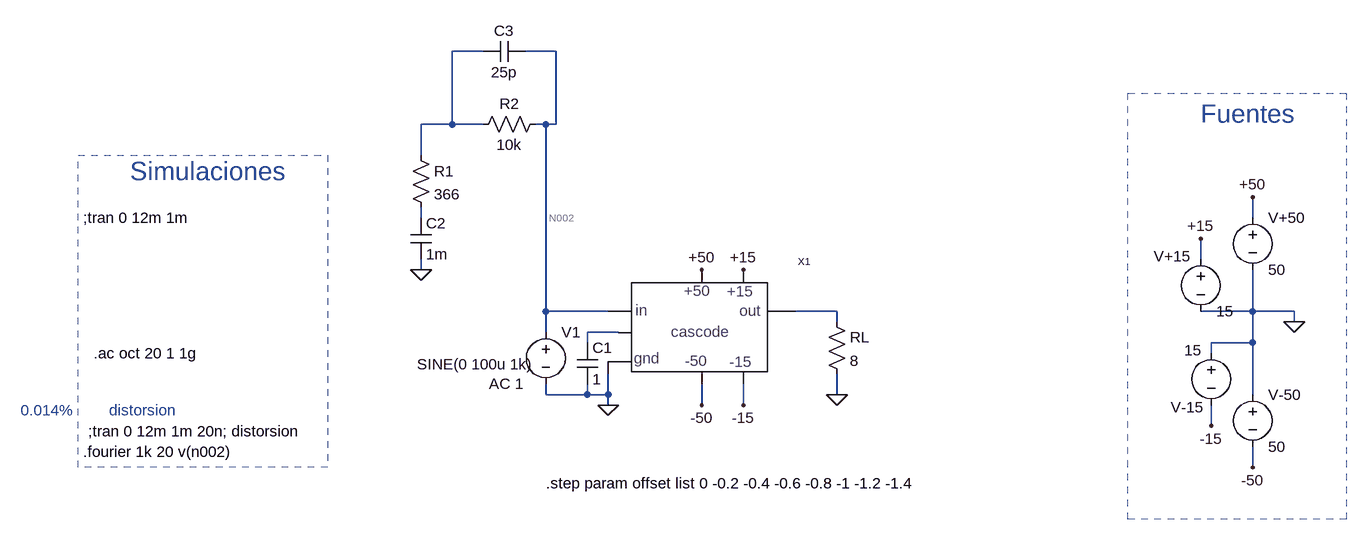
[diagram p0: schematic ampli-div-ten-la.asc]
ampli-div-ten-la.asc, the LTspice schematic file:
Version 4
SHEET 1 1188 880
WIRE -144 -288 -192 -288
WIRE -32 -288 -80 -288
WIRE -192 -176 -192 -288
WIRE -192 -176 -240 -176
WIRE -144 -176 -192 -176
WIRE -48 -176 -64 -176
WIRE -32 -176 -32 -288
WIRE -32 -176 -48 -176
WIRE -240 -128 -240 -176
WIRE -240 -32 -240 -48
WIRE 1040 -32 1040 -64
WIRE 960 32 960 0
WIRE -240 48 -240 32
WIRE -48 112 -48 -176
WIRE 48 112 -48 112
WIRE 400 112 336 112
WIRE 1040 112 1040 48
WIRE 1040 112 960 112
WIRE 1104 112 1040 112
WIRE 400 128 400 112
WIRE 1104 128 1104 112
WIRE -48 144 -48 112
WIRE 64 144 16 144
WIRE 16 160 16 144
WIRE 1040 160 1040 112
WIRE 1040 160 976 160
WIRE 976 176 976 160
WIRE -48 240 -48 224
WIRE 16 240 16 224
WIRE 16 240 -48 240
WIRE 48 240 48 208
WIRE 48 240 16 240
WIRE 400 240 400 208
WIRE 1040 240 1040 160
WIRE 48 256 48 240
WIRE 192 256 192 224
WIRE 256 256 256 224
WIRE 976 288 976 256
WIRE 1040 352 1040 320
FLAG 1104 128 0
FLAG 400 240 0
FLAG 1040 -64 +50
FLAG 960 0 +15
FLAG 976 288 -15
FLAG 1040 352 -50
FLAG 192 48 +50
FLAG 256 48 +15
FLAG 192 256 -50
FLAG 256 256 -15
FLAG 48 256 0
FLAG -240 48 0
SYMBOL rui\\shortcuts\\voltage 976 160 R0
WINDOW 0 -62 99 Left 2
WINDOW 3 -41 12 Left 2
WINDOW 123 0 0 Left 2
WINDOW 39 0 0 Left 2
SYMATTR InstName V-15
SYMATTR Value 15
SYMBOL rui\\shortcuts\\voltage 1040 -48 R0
SYMATTR InstName V+50
SYMATTR Value 50
SYMBOL rui\\shortcuts\\voltage 960 16 R0
WINDOW 0 -72 11 Left 2
SYMATTR InstName V+15
SYMATTR Value 15
SYMBOL rui\\shortcuts\\voltage -48 128 R0
WINDOW 3 -198 65 Left 2
WINDOW 123 -87 95 Left 2
WINDOW 39 0 0 Left 2
SYMATTR Value SINE(0 100u 1k)
SYMATTR Value2 AC 1
SYMATTR InstName V1
SYMBOL res 384 112 R0
SYMATTR InstName RL
SYMATTR Value 8
SYMBOL rui\\shortcuts\\voltage 1040 224 R0
SYMATTR InstName V-50
SYMATTR Value 50
SYMBOL cap 0 160 R0
SYMATTR InstName C1
SYMATTR Value 1
SYMBOL ss-ampli-div-ten 192 128 R0
SYMATTR InstName X1
SYMBOL res -256 -144 R0
SYMATTR InstName R1
SYMATTR Value 366
SYMBOL res -48 -192 R90
WINDOW 0 0 56 VBottom 2
WINDOW 3 32 56 VTop 2
SYMATTR InstName R2
SYMATTR Value 10k
SYMBOL cap -256 -32 R0
SYMATTR InstName C2
SYMATTR Value 1m
SYMBOL cap -80 -304 R90
WINDOW 0 0 32 VBottom 2
WINDOW 3 32 32 VTop 2
SYMATTR InstName C3
SYMATTR Value 25p
TEXT -760 -32 Left 2 !;tran 0 12m 1m
TEXT -760 328 Left 2 !.fourier 1k 20 v(n002)
TEXT 960 -192 Left 4 ;Fuentes
TEXT -688 -104 Left 4 ;Simulaciones
TEXT -752 296 Left 2 !;tran 0 12m 1m 20n; distorsion
TEXT -720 264 Left 2 ;distorsion
TEXT -856 264 Left 2 ;0.014%
TEXT -744 176 Left 2 !.ac oct 20 1 1g
TEXT -48 376 Left 2 !.step param offset list 0 -0.2 -0.4 -0.6 -0.8 -1 -1.2 -1.4
RECTANGLE Normal 1184 432 848 -224 2
RECTANGLE Normal -384 352 -768 -128 2

The netlist it stands for:
* ampli-div-ten-la.asc
V-15 0 -15 15
V+50 +50 0 50
V+15 +15 0 15
V1 N002 0 SINE(0 100u 1k) AC 1
RL N004 0 8
V-50 0 -50 50
C1 N005 0 1
XX1 0 N002 N004 +50 -50 +15 -15 N005 ss-ampli-div-ten  ; pins grnd i o +50 -50 +15 -15 i_aux
R1 N001 N003 366
R2 N002 N001 10k
C2 N003 0 1m
C3 N002 N001 25p
;tran 0 12m 1m
.fourier 1k 20 v(n002)
* Fuentes
* Simulaciones
;tran 0 12m 1m 20n; distorsion
* distorsion
* 0.014%
.ac oct 20 1 1g
.step param offset list 0 -0.2 -0.4 -0.6 -0.8 -1 -1.2 -1.4
.backanno
.end